# Altium schematic sheet BOARD.SchDoc
size A
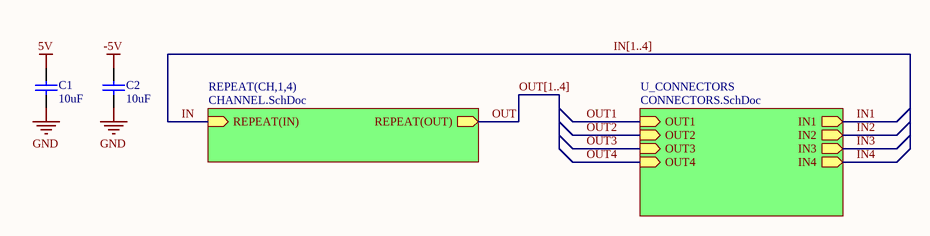
[diagram p0: BOARD.SchDoc]

## Parts
C1  value 10uF  [1608[0603]]  (hidden comment: Cap Semi)
C2  value 10uF  [1608[0603]]  (hidden comment: Cap Semi)

## Sub-sheets
REPEAT(CH,1,4) = CHANNEL.SchDoc: REPEAT(IN) (in), REPEAT(OUT) (out)
U_CONNECTORS = CONNECTORS.SchDoc: IN1 (out), IN2 (out), IN3 (out), IN4 (out), OUT1 (in), OUT2 (in), OUT3 (in), OUT4 (in)

## Nets
5V: C1.2
-5V: C2.2
GND: C1.1 C2.1
IN: sheet REPEAT(CH,1,4)/REPEAT(IN)
IN1: sheet U_CONNECTORS/IN1
IN2: sheet U_CONNECTORS/IN2
IN3: sheet U_CONNECTORS/IN3
IN4: sheet U_CONNECTORS/IN4
OUT: sheet REPEAT(CH,1,4)/REPEAT(OUT)
OUT1: sheet U_CONNECTORS/OUT1
OUT2: sheet U_CONNECTORS/OUT2
OUT3: sheet U_CONNECTORS/OUT3
OUT4: sheet U_CONNECTORS/OUT4

## Buses and harness runs
bus IN[1..4]
bus OUT[1..4]

## Library data of the parts
C1 C2 = Cap Semi: Capacitor (Semiconductor SIM Model); Published: 8-Jun-2000; LatestRevisionDate: 29-May-2009; LatestRevisionNote: IPC-7351 Footprint Added.; PackageReference: C1206; Publisher: Altium Limited; PackageDescription: Chip Capacitor